# EAGLE design gadget_pcb (EAGLE 6.1)
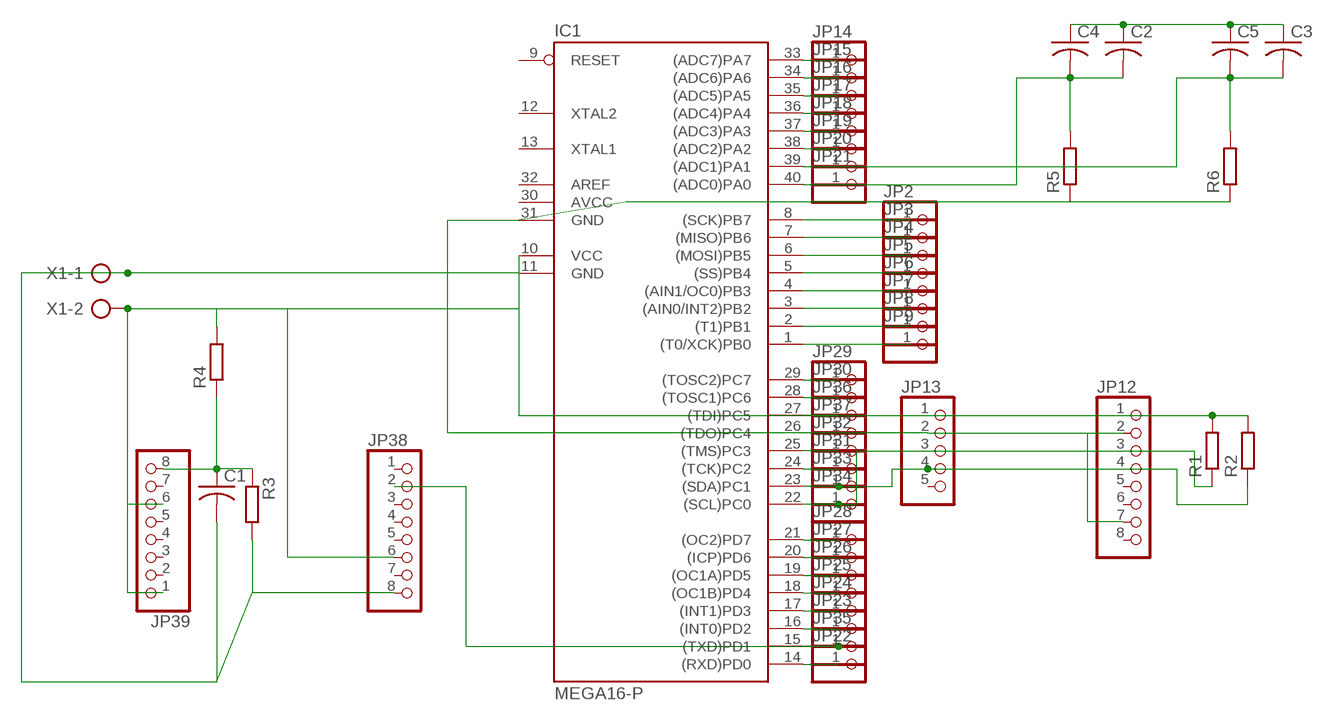
[diagram p0: schematic, sheet 1]

## Parts
C1  C-US050-024X044  [C050-024X044]
C2  C-US050-024X044  [C050-024X044]
C3  C-US050-024X044  [C050-024X044]
C4  C-US050-045X075  [C050-045X075]
C5  C-US050-045X075  [C050-045X075]
IC1  MEGA16-P  [DIL40]
JP2  PINHD-1X1  [1X01]
JP3  PINHD-1X1  [1X01]
JP4  PINHD-1X1  [1X01]
JP5  PINHD-1X1  [1X01]
JP6  PINHD-1X1  [1X01]
JP7  PINHD-1X1  [1X01]
JP8  PINHD-1X1  [1X01]
JP9  PINHD-1X1  [1X01]
JP12  PINHD-1X8  [1X08]
JP13  PINHD-1X5  [1X05]
JP14  PINHD-1X1  [1X01]
JP15  PINHD-1X1  [1X01]
JP16  PINHD-1X1  [1X01]
JP17  PINHD-1X1  [1X01]
JP18  PINHD-1X1  [1X01]
JP19  PINHD-1X1  [1X01]
JP20  PINHD-1X1  [1X01]
JP21  PINHD-1X1  [1X01]
JP22  PINHD-1X1  [1X01]
JP23  PINHD-1X1  [1X01]
JP24  PINHD-1X1  [1X01]
JP25  PINHD-1X1  [1X01]
JP26  PINHD-1X1  [1X01]
JP27  PINHD-1X1  [1X01]
JP28  PINHD-1X1  [1X01]
JP29  PINHD-1X1  [1X01]
JP30  PINHD-1X1  [1X01]
JP31  PINHD-1X1  [1X01]
JP32  PINHD-1X1  [1X01]
JP33  PINHD-1X1  [1X01]
JP34  PINHD-1X1  [1X01]
JP35  PINHD-1X1  [1X01]
JP36  PINHD-1X1  [1X01]
JP37  PINHD-1X1  [1X01]
JP38  PINHD-1X8  [1X08]
JP39  PINHD-1X8  [1X08]
R1  R-EU_0207/10  [0207/10]
R2  R-EU_0207/10  [0207/10]
R3  R-EU_0207/5V  [0207/5V]
R4  R-EU_0207/10  [0207/10]
R5  R-EU_0207/7  [0207/7]
R6  R-EU_0207/7  [0207/7]
X1  AK500/2  [AK500/2]

## Nets
N$1: IC1.27((TDI)PC5) JP36.1
N$2: IC1.26((TDO)PC4) JP37.1
N$3: IC1.15((TXD)PD1) JP35.1 JP38.2
N$4: IC1.4((AIN1/OC0)PB3) JP6.1
N$5: IC1.2((T1)PB1) JP8.1
N$6: IC1.3((AIN0/INT2)PB2) JP7.1
N$7: IC1.1((T0/XCK)PB0) JP9.1
N$8: IC1.5((SS)PB4) JP5.1
N$9: IC1.6((MOSI)PB5) JP4.1
N$10: IC1.7((MISO)PB6) JP3.1
N$11: IC1.8((SCK)PB7) JP2.1
N$12: IC1.22((SCL)PC0) JP12.3 JP13.3 JP34.1 R1.1
N$13: IC1.23((SDA)PC1) JP12.4 JP13.4 JP33.1 R2.1
N$14: IC1.33((ADC7)PA7) JP14.1
N$15: IC1.34((ADC6)PA6) JP15.1
N$16: IC1.35((ADC5)PA5) JP16.1
N$17: IC1.36((ADC4)PA4) JP17.1
N$18: IC1.37((ADC3)PA3) JP18.1
N$19: IC1.38((ADC2)PA2) JP19.1
N$20: C3.2 C5.2 IC1.39((ADC1)PA1) JP20.1 R6.2
N$21: C2.2 C4.2 IC1.40((ADC0)PA0) JP21.1 R5.2
N$22: IC1.14((RXD)PD0) JP22.1
N$23: IC1.16((INT0)PD2) JP23.1
N$24: IC1.17((INT1)PD3) JP24.1
N$25: IC1.18((OC1B)PD4) JP25.1
N$26: IC1.19((OC1A)PD5) JP26.1
N$27: IC1.20((ICP)PD6) JP27.1
N$28: IC1.21((OC2)PD7) JP28.1
N$29: IC1.29((TOSC2)PC7) JP29.1
N$30: IC1.28((TOSC1)PC6) JP30.1
N$31: IC1.24((TCK)PC2) JP31.1
N$32: IC1.25((TMS)PC3) JP32.1
N$33: IC1.10(VCC) JP12.1 JP13.1 JP38.6 JP39.1 JP39.6 R1.2 R2.2 R4.2 X1.2
N$34: C1.2 IC1.11(GND) IC1.31(GND) JP12.2 JP12.7 JP13.2 JP38.8 R3.2 R5.1 R6.1 X1.1
N$36: C1.1 JP39.8 R3.1 R4.1
N$45: C2.1 C3.1 C4.1 C5.1
Unconnected: IC1.9(RESET) IC1.12(XTAL2) IC1.13(XTAL1) IC1.32(AREF) JP12.5 JP12.6 JP12.8 JP13.5 JP38.1 JP38.3 JP38.4 JP38.5 JP38.7 JP39.2 JP39.3 JP39.4 JP39.5 JP39.7

## Power pins joined to a net without a drawn wire
AVCC: IC1.30(AVCC)

## Library data of the parts
C1-C5 = rcl:C-US: CAPACITOR, American symbol
IC1 = atmel:MEGA16-P: MICROCONTROLLER 16 Kbytes FLASH 1 kbytes SRAM 512 bytes EEPROM USART 8-channel 10 bit ADC Source: avr.lbr; MPN: ATMEGA16-16PU; OC_FARNELL: 9171142; OC_NEWARK: 01M6885
JP2-JP9 JP14-JP37 = pinhead:PINHD-1X1: PIN HEADER
JP12 JP38 JP39 = pinhead:PINHD-1X8: PIN HEADER
JP13 = pinhead:PINHD-1X5: PIN HEADER
R1-R6 = rcl:R-EU_: RESISTOR, European symbol
X1 = con-ptr500:AK500/2: CONNECTOR; OC_FARNELL: unknown; OC_NEWARK: unknown

## Board
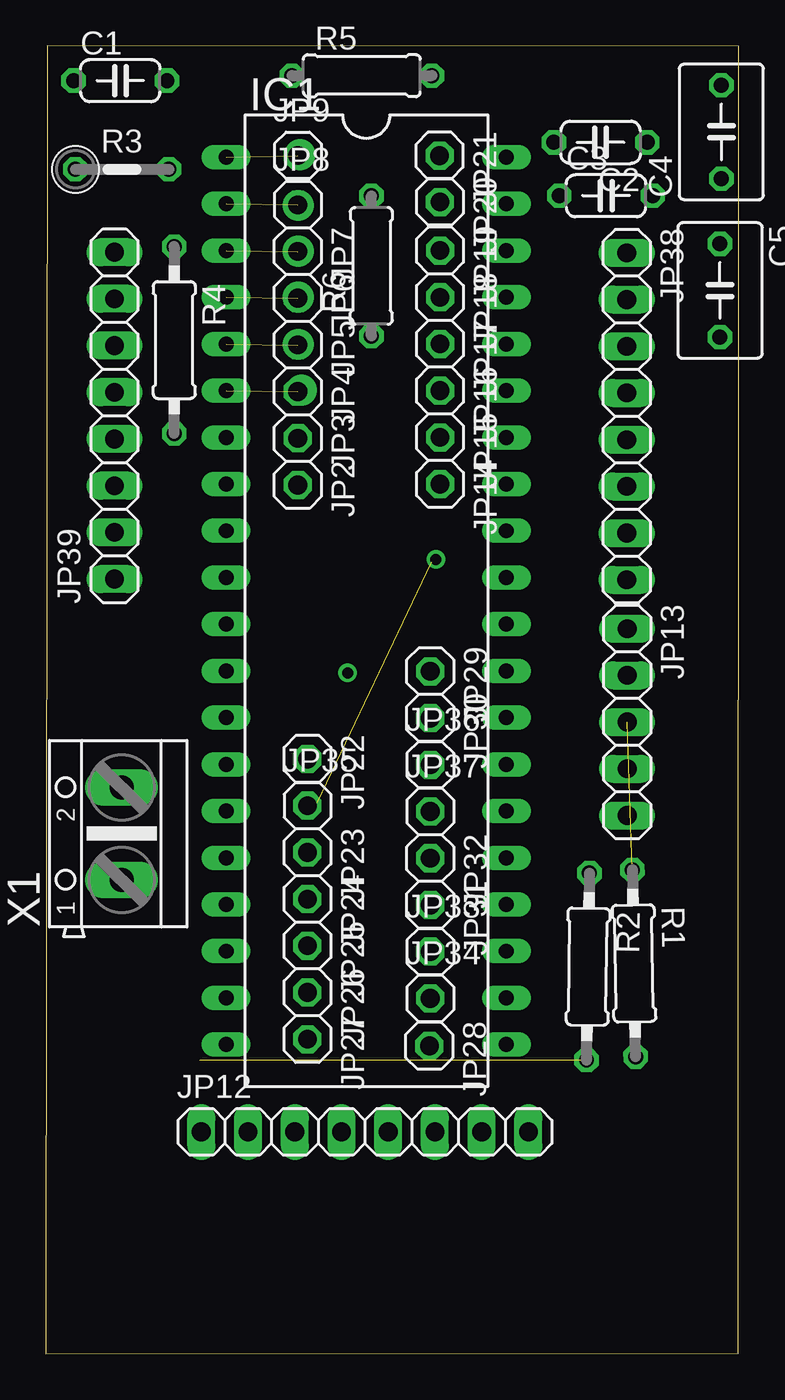
[diagram p1: board, top side]
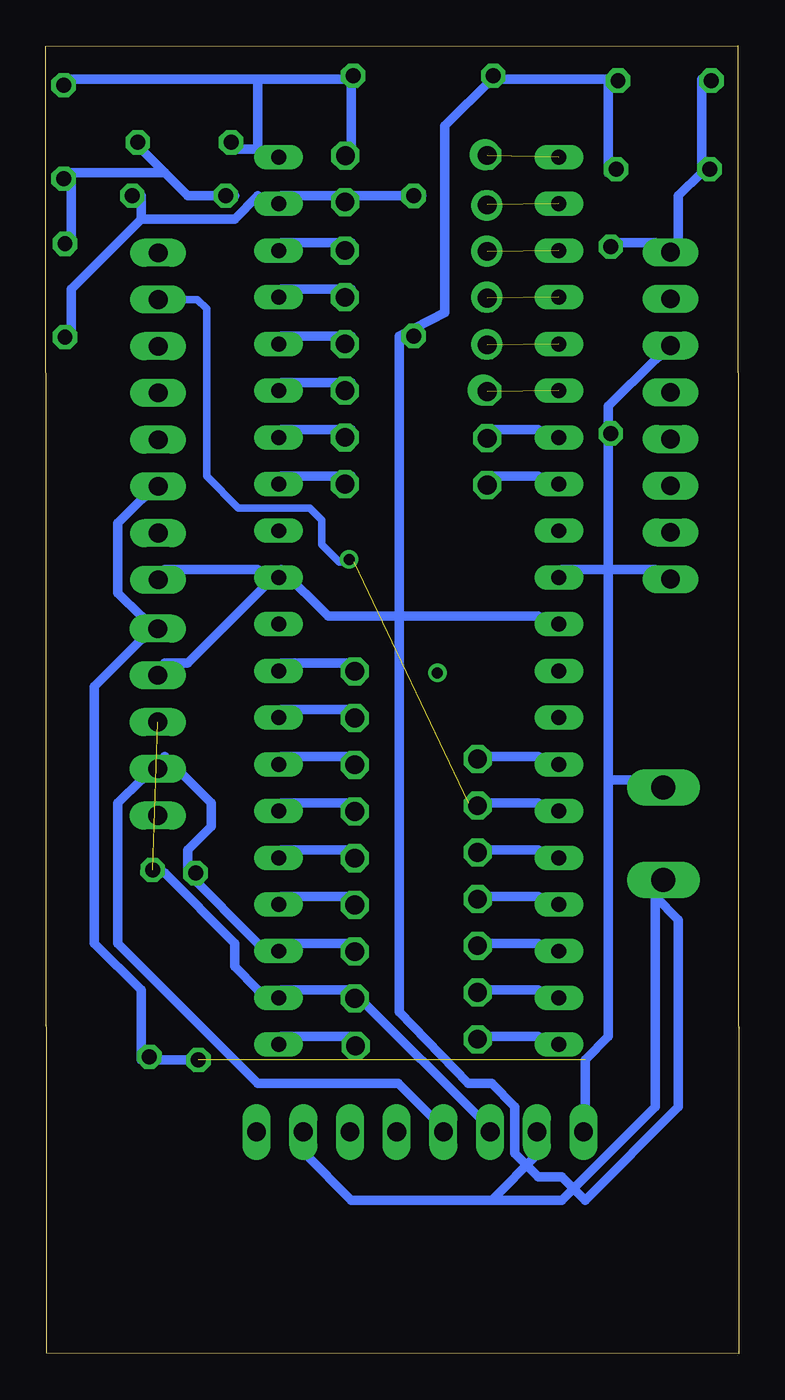
[diagram p2: board, bottom side, seen from below]

Size 37.67 x 71.11 mm. Coordinates in mm from the lower left corner, seen from the top.
Outline: 0,0 37.64,0.01 37.67,71.09 0.06,71.11 0,0
Copper layers (1*16): Top 0.035mm / dielectric 1.5mm / Bottom 0.035mm
Design rules: minimum track width 20mil, minimum drill 24mil, track to track 8mil, track to pad 8mil, pad to pad 8mil, via to via 8mil, smd to smd 8mil, copper to edge 40mil, drill to drill 8mil, minimum pad ring 10mil, minimum via ring 8mil, stop-mask expansion 4mil, vias tented up to drill 0mil, thermal gap 10mil

### Footprints (pad centres in the part's own frame; a part is rotated, then mirrored left to right if it is on the bottom)
C050-024X044 = drill 0.813 octagon: 1 -2.54,0; 2 2.54,0
C050-045X075 = drill 0.813 octagon: 1 -2.54,0; 2 2.54,0
DIL40 = drill 0.813 long: 1 -24.13,-7.62; 2 -21.59,-7.62; 3 -19.05,-7.62; 4 -16.51,-7.62; 5 -13.97,-7.62; 6 -11.43,-7.62; 7 -8.89,-7.62; 8 -6.35,-7.62; 9 -3.81,-7.62; 10 -1.27,-7.62; 11 1.27,-7.62; 12 3.81,-7.62; 13 6.35,-7.62; 14 8.89,-7.62; 15 11.43,-7.62; 16 13.97,-7.62; 17 16.51,-7.62; 18 19.05,-7.62; 19 21.59,-7.62; 20 24.13,-7.62; 21 24.13,7.62; 22 21.59,7.62; 23 19.05,7.62; 24 16.51,7.62; 25 13.97,7.62; 26 11.43,7.62; 27 8.89,7.62; 28 6.35,7.62; 29 3.81,7.62; 30 1.27,7.62; 31 -1.27,7.62; 32 -3.81,7.62; 33 -6.35,7.62; 34 -8.89,7.62; 35 -11.43,7.62; 36 -13.97,7.62; 37 -16.51,7.62; 38 -19.05,7.62; 39 -21.59,7.62; 40 -24.13,7.62
1X01 = drill 1.016 octagon: 1 0,0
1X08 = drill 1.016 long: 1 -8.89,0; 2 -6.35,0; 3 -3.81,0; 4 -1.27,0; 5 1.27,0; 6 3.81,0; 7 6.35,0; 8 8.89,0
1X05 = drill 1.016 long: 1 -5.08,0; 2 -2.54,0; 3 0,0; 4 2.54,0; 5 5.08,0
0207/10 = drill 0.813 octagon: 1 -5.08,0; 2 5.08,0
0207/5V = drill 0.813 octagon: 1 -2.54,0; 2 2.54,0
0207/7 = drill 0.813 octagon: 1 -3.81,0; 2 3.81,0
AK500/2 = drill 1.321 long: 1 -2.515,0; 2 2.515,0

### Placement (x,y rotation side)
C1  4.04,69.23 0 top
C2  30.15,65.86 180 top
C3  30.44,62.97 0 top
C4  36.72,66.43 90 top
C5  36.64,57.81 270 top
IC1  17.41,40.93 270 top
JP2  13.69,47.23 270 top
JP3  13.69,49.77 270 top
JP4  13.69,52.31 270 top
JP5  13.69,54.85 270 top
JP6  13.69,57.39 270 top
JP7  13.69,59.93 270 top
JP8  13.69,62.47 0 top
JP9  13.69,65.15 0 top
JP12  17.34,12.05 0 top
JP13  31.6,34.34 270 top
JP14  21.42,47.28 270 top
JP15  21.42,49.82 270 top
JP16  21.42,52.36 270 top
JP17  21.42,54.9 270 top
JP18  21.42,57.44 270 top
JP19  21.42,59.98 270 top
JP20  21.41,62.62 270 top
JP21  21.4,65.14 270 top
JP22  14.21,32.33 270 top
JP23  14.21,27.25 270 top
JP24  14.21,24.71 270 top
JP25  14.21,22.17 270 top
JP26  14.21,19.63 270 top
JP27  14.21,17.09 270 top
JP28  20.84,16.73 270 top
JP29  20.89,37.1 270 top
JP30  20.89,34.56 270 top
JP31  20.89,24.4 270 top
JP32  20.89,26.94 270 top
JP33  20.89,21.86 0 top
JP34  20.89,19.32 0 top
JP35  14.21,29.79 0 top
JP36  20.89,32.02 0 top
JP37  20.89,29.48 0 top
JP38  31.57,50.97 270 top
JP39  3.72,51 90 top
R1  31.97,21.22 271 top
R2  29.46,21.04 269.1 top
R3  4.14,64.4 0 top
R4  6.97,55.12 270 top
R5  17.17,69.49 0 top
R6  17.69,59.14 90 top
X1  4.11,28.27 90 top

### Tracks (layer width: path | path; a pad name or v marks a point on that pad's centre or on a via)
N$1
  Bottom 0.508: IC1.27 24.88,32.47 21.07,32.47 JP36.1
N$2
  Bottom 0.508: IC1.26 24.88,29.93 21.07,29.93 JP37.1
N$3  (1 unrouted)
  Bottom 0.406: JP38.2 29.44,57.31 28.94,56.82 28.94,47.71 27.22,45.99 23.34,45.99 22.67,45.31 22.67,43.98 21.73,43.04 20.94,43.04
  Bottom 0.508: IC1.15 10.91,29.93 14.72,29.93 JP35.1
N$4  (1 unrouted)
N$5  (1 unrouted)
N$6  (1 unrouted)
N$7  (1 unrouted)
N$8  (1 unrouted)
N$9  (1 unrouted)
N$10
  Bottom 0.508: IC1.7 10.91,50.25 13.45,50.25 JP3.1
N$11
  Bottom 0.508: IC1.8 10.91,47.71 13.45,47.71 JP2.1
N$12  (1 unrouted)
  Bottom 0.508: 21.07,19.77 24.88,19.77 IC1.22 26.15,19.77 27.42,21.04 27.42,22.31 31.23,26.12 R1.1 | 21.07,19.77 13.45,12.15 JP12.3 | 21.07,19.77 JP34.1
N$13
  Bottom 0.508: JP33.1 21.07,22.31 24.88,22.31 IC1.23 26.15,22.31 29.96,26.12 | JP12.4 15.99,12.15 18.53,14.69 26.15,14.69 33.77,22.31 33.77,29.93 32.5,31.2 JP13.4 31.23,32.47 28.69,29.93 28.69,28.66 29.96,27.39 29.96,26.12 | 29.96,26.12 R2.1
N$14
  Bottom 0.508: IC1.33 24.88,47.71 21.07,47.71 JP14.1
N$15
  Bottom 0.508: IC1.34 24.88,50.25 21.07,50.25 JP15.1
N$16
  Bottom 0.508: IC1.35 24.88,52.79 21.07,52.79 JP16.1
N$17
  Bottom 0.508: IC1.36 24.88,55.33 21.07,55.33 JP17.1
N$18
  Bottom 0.508: IC1.37 24.88,57.87 21.07,57.87 JP18.1
N$19
  Bottom 0.508: IC1.38 24.88,60.41 21.07,60.41 JP19.1
N$20
  Bottom 0.508: 21.07,62.95 R6.2 17.26,62.95 | 21.07,62.95 24.88,62.95 IC1.39 26.15,62.95 27.42,61.68 32.5,61.68 | 21.07,62.95 JP20.1 | 32.5,61.68 36.31,57.87 36.31,55.33 C5.2 | 32.5,61.68 32.5,62.95 C3.2
N$21
  Bottom 0.508: 26.15,65.49 27.42,65.49 C2.2 | 21.07,69.3 26.15,69.3 | 26.15,69.3 36.31,69.3 C4.2 | 21.07,69.3 21.07,65.49 JP21.1 | 21.07,69.3 R5.2 | 26.15,69.3 26.15,65.49 | 26.15,65.49 IC1.40
N$22
  Bottom 0.508: IC1.14 10.91,32.47 14.72,32.47 JP22.1
N$23
  Bottom 0.508: IC1.16 10.91,27.39 14.72,27.39 JP23.1
N$24
  Bottom 0.508: IC1.17 10.91,24.85 14.72,24.85 JP24.1
N$25
  Bottom 0.508: IC1.18 10.91,22.31 14.72,22.31 JP25.1
N$26
  Bottom 0.508: IC1.19 10.91,19.77 14.72,19.77 JP26.1
N$27
  Bottom 0.508: IC1.20 10.91,17.23 14.72,17.23 JP27.1
N$28
  Bottom 0.508: IC1.21 24.88,17.23 21.07,17.23 JP28.1
N$29
  Bottom 0.508: IC1.29 24.88,37.55 21.07,37.55 JP29.1
N$30
  Bottom 0.508: IC1.28 24.88,35.01 21.07,35.01 JP30.1
N$31
  Bottom 0.508: IC1.24 24.88,24.85 21.07,24.85 JP31.1
N$32
  Bottom 0.508: IC1.25 24.88,27.39 21.07,27.39 JP32.1
N$33  (1 unrouted)
  Bottom 0.508: 32.5,15.96 29.96,15.96 R2.2 | JP38.6 32.5,46.44 33.77,45.17 33.77,41.36 32.5,40.09 JP13.1 32.5,38.82 35.04,36.28 35.04,22.31 32.5,19.77 32.5,15.96 | 32.5,15.96 R1.2 | 7.1,42.63 4.56,42.63 JP39.1 | 7.1,42.63 9.64,42.63 IC1.10 | 7.1,42.63 7.1,50.25 | 7.1,42.63 7.1,31.2 | 7.1,31.2 7.1,17.23 8.37,15.96 8.37,12.15 JP12.1 | 7.1,50.25 7.1,51.52 4.56,54.06 JP39.6 | 7.1,50.25 R4.2 | 7.1,31.2 4.56,31.2 X1.2
N$34
  Bottom 0.508: 13.45,8.34 10.91,10.88 JP12.2 | 13.45,8.34 21.07,8.34 23.61,10.88 JP12.7 | 4.56,24.85 4.56,13.42 9.64,8.34 13.45,8.34 | 7.1,69.3 7.1,64.22 R3.2 | 7.1,69.3 13.45,69.3 | 7.1,69.3 C1.2 | 18.48,40.09 22.34,40.09 24.88,42.63 | 18.48,40.09 10.91,40.09 IC1.11 | 18.48,40.09 18.48,55.33 | 24.88,42.63 29.96,37.55 31.23,37.55 JP13.2 | 24.88,42.63 IC1.31 26.15,42.63 31.23,42.63 JP38.8 | 13.45,69.3 15.99,66.76 15.99,56.6 18.48,55.33 | 13.45,69.3 R5.1 | 18.48,55.33 R6.1 | 4.56,24.85 3.29,23.58 3.29,13.42 8.37,8.34 9.64,9.61 10.91,9.61 12.18,10.88 12.18,13.42 13.45,14.69 14.72,14.69 18.47,18.57 18.48,40.09 | 4.56,24.85 X1.1
N$35  (via drill 0.6 pad 1.68)
  other vias: 13.8,65.19
N$36
  Bottom 0.508: R4.1 7.1,60.41 4.56,60.41 JP39.8 3.29,60.41 3.29,62.95 2.02,64.22 | 2.02,64.22 2.02,69.3 C1.1 | 2.02,64.22 R3.1
N$37  (via drill 0.6 pad 1.68)
  other vias: 13.72,62.43
N$38  (via drill 0.6 pad 1.68)
  other vias: 13.72,59.94
N$39  (via drill 0.6 pad 1.68)
  other vias: 13.72,57.45
N$40  (via drill 0.6 pad 1.68)
  other vias: 13.72,54.88
N$41  (via drill 0.6 pad 1.68)
  other vias: 13.89,52.4
N$42  (via drill 0.6)
  other vias: 21.2,43.18
N$43  (via drill 0.6)
  other vias: 16.4,37.02
N$45
  Bottom 0.508: 36.31,64.22 36.31,60.41 C5.1 | 31.23,64.22 32.5,65.49 C2.1 | 31.23,64.22 29.96,62.95 27.42,62.95 C3.1 | 31.23,64.22 36.31,64.22 | 36.31,64.22 C4.1